# Altium schematic sheet Compute_Module_TOP.SchDoc: STM32F446 CNC
size B; Author: AM; CompanyName: Expatria Technologies; DrawnBy: A.Marles; Engineer: AM; Organization: Expatria Technolgoies; Address1: 1136 Glade Court; Address3: Port Coquitlam, BC V3B 1R5; Address4: Canada; DocumentNumber: 7; SheetNumber: 7; SheetTotal: 30
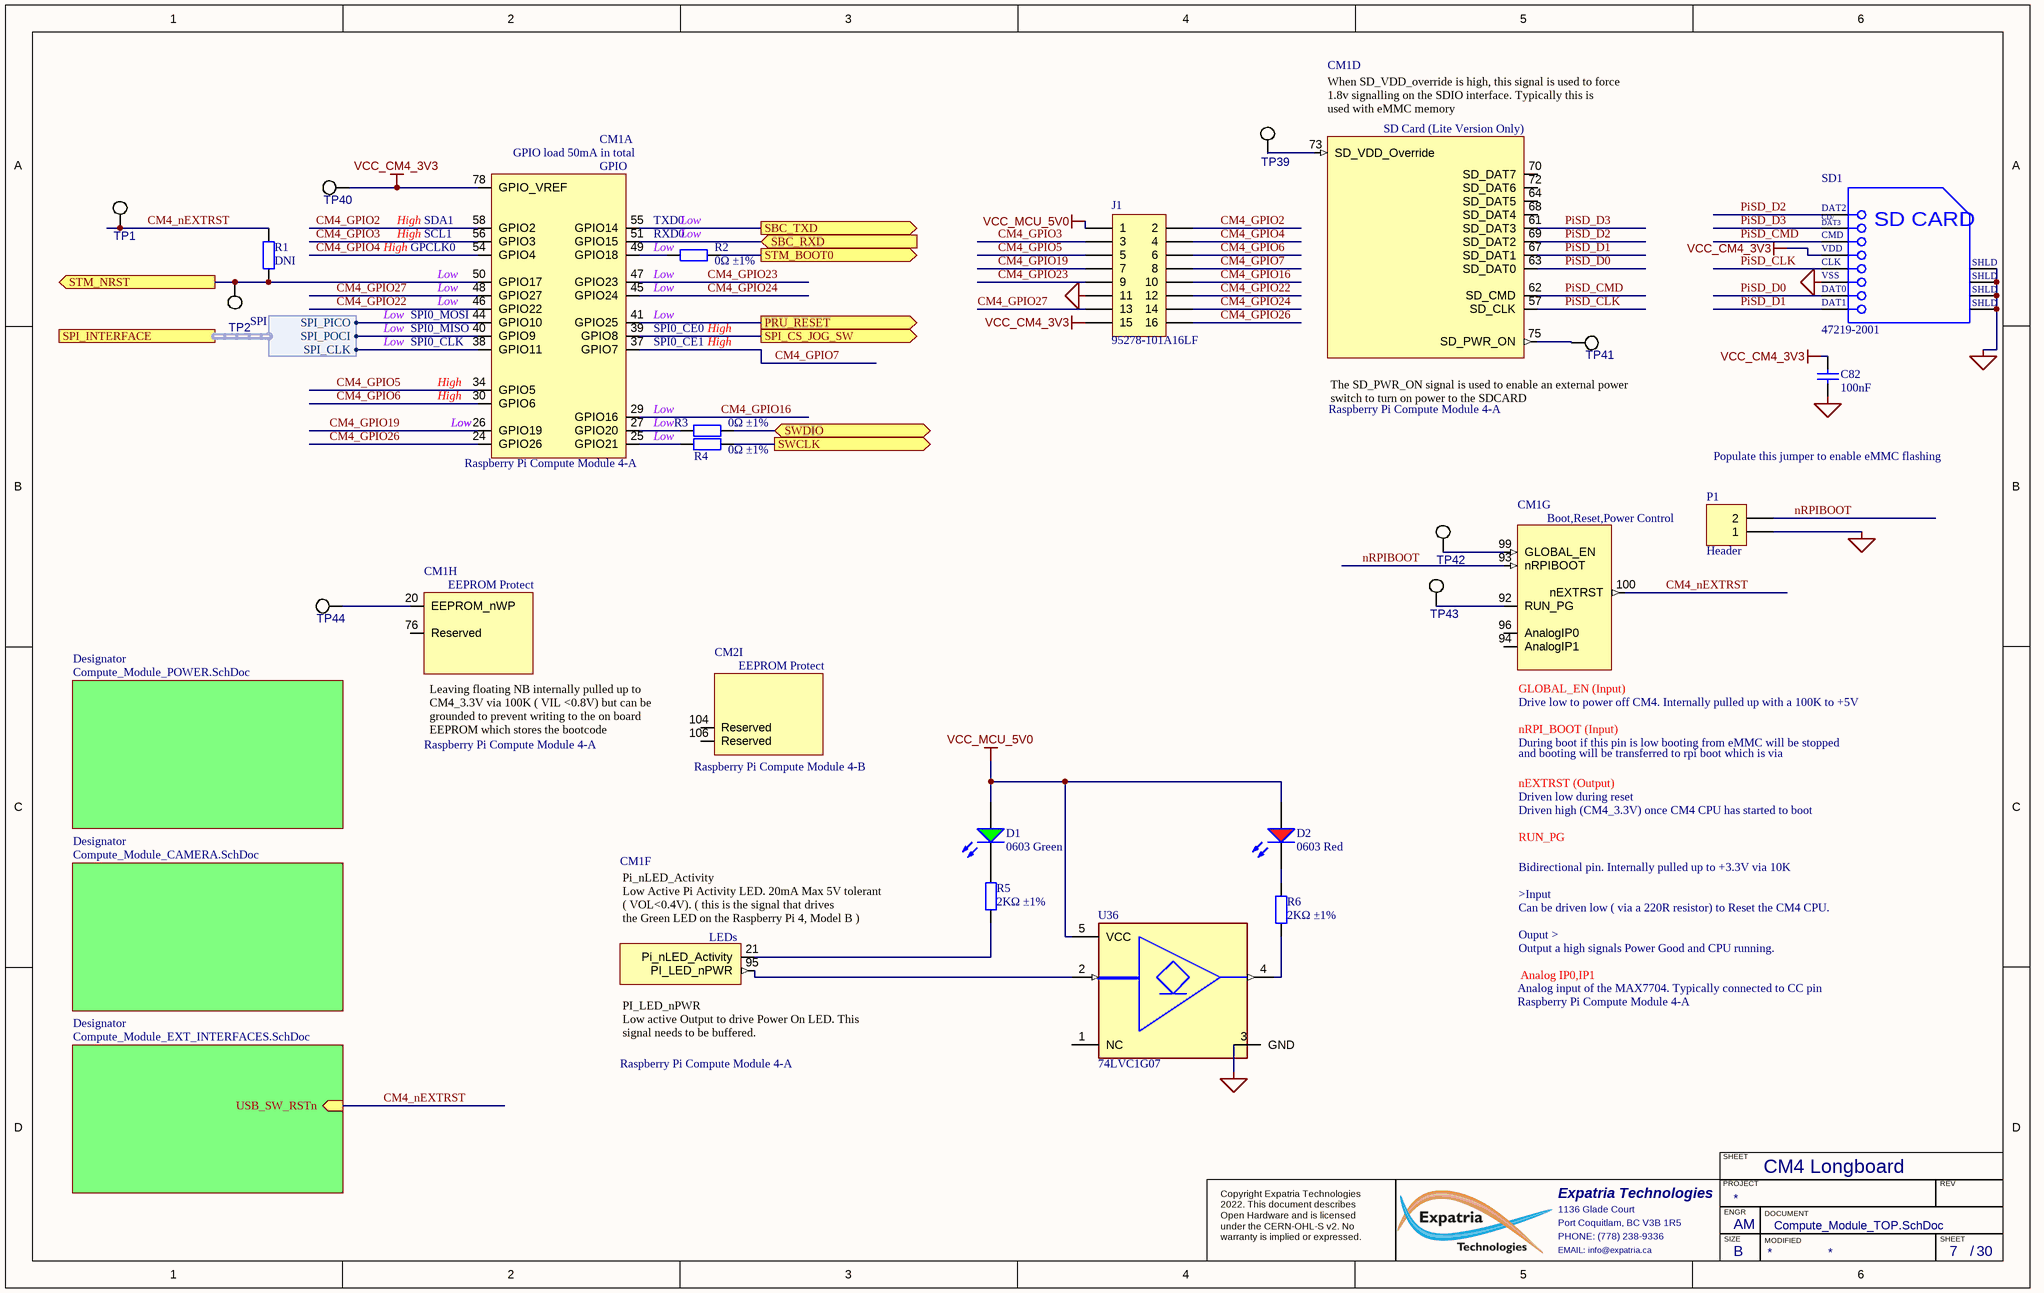
[diagram p0: Compute_Module_TOP.SchDoc]

## Parts
C82  100nF  [0603_C]
CM1  Raspberry Pi Compute Module 4-A  [DF40HC30100DS04V51]  (parts A,D,F,G,H of 14)
CM2  Raspberry Pi Compute Module 4-B  [DF40HC30100DS04V51 - p101-200]  (part I of 10)
D1  0603 Green  [0603_LED_S1]
D2  0603 Red  [0603_LED_S1]
J1  95278-101A16LF  [95278101A16LF]
P1  Header  [HDR1X2]
R1  DNI  [0603_R]
R2  0Ω ±1%  [0603_R]
R3  0Ω ±1%  [0603_R]
R4  0Ω ±1%  [0603_R]
R5  2KΩ ±1%  [0603_R]
R6  2KΩ ±1%  [0603_R]
SD1  47219-2001  [472192001]
TP1  TESTPOINT  [TP/SMALL]  (value not drawn)  (no BOM)
TP2  TESTPOINT  [TP/SMALL]  (value not drawn)  (no BOM)
TP39  TESTPOINT  [TP/SMALL]  (value not drawn)  (no BOM)
TP40  TESTPOINT  [TP/SMALL]  (value not drawn)  (no BOM)
TP41  TESTPOINT  [TP/SMALL]  (value not drawn)  (no BOM)
TP42  TESTPOINT  [TP/SMALL]  (value not drawn)  (no BOM)
TP43  TESTPOINT  [TP/SMALL]  (value not drawn)  (no BOM)
TP44  TESTPOINT  [TP/SMALL]  (value not drawn)  (no BOM)
U36  74LVC1G07  [SOT65P210X110-5N]

## Sub-sheets
Designator = Compute_Module_POWER.SchDoc: no entries
Designator = Compute_Module_EXT_INTERFACES.SchDoc: USB_SW_RSTn (in)
Designator = Compute_Module_CAMERA.SchDoc: no entries

## Ports
PRU_RESET (out), SBC_RXD (in), SBC_TXD (out), SPI_CS_JOG_SW (out), SPI_INTERFACE (harness SPI), STM_BOOT0 (out), STM_NRST (out), SWCLK (out), SWDIO (bidir)

## Harnesses
SPI: SPI_CLK, SPI_PICO, SPI_POCI

## Nets
MCU_GND: C82.1 J1.11 P1.1 SD1.6(VSS) SD1.9(SHLD) SD1.10(SHLD) SD1.11(SHLD) SD1.12(SHLD) U36.3(GND)
VCC_CM4_3V3: C82.2 CM1.78(GPIO_VREF) J1.15 SD1.4(VDD) TP40.1
VCC_MCU_5V0: D1.A D2.A J1.1 U36.5(VCC)
CM4_GPIO2: CM1.58(GPIO2) J1.2
CM4_GPIO3: CM1.56(GPIO3) J1.3
CM4_GPIO4: CM1.54(GPIO4) J1.4
CM4_GPIO5: CM1.34(GPIO5) J1.5
CM4_GPIO6: CM1.30(GPIO6) J1.6
CM4_GPIO7: CM1.37(GPIO7) J1.8
CM4_GPIO16: CM1.29(GPIO16) J1.10
CM4_GPIO19: CM1.26(GPIO19) J1.7
CM4_GPIO22: CM1.46(GPIO22) J1.12
CM4_GPIO23: CM1.47(GPIO23) J1.9
CM4_GPIO24: CM1.45(GPIO24) J1.14
CM4_GPIO26: CM1.24(GPIO26) J1.16
CM4_GPIO27: CM1.48(GPIO27) J1.13
CM4_nEXTRST: CM1.100(nEXTRST) R1.2 TP1.1 ; sheet Designator/USB_SW_RSTn
nRPIBOOT: CM1.93(nRPIBOOT) P1.2
PiSD_CLK: CM1.57(SD_CLK) SD1.5(CLK)
PiSD_CMD: CM1.62(SD_CMD) SD1.3(CMD)
PiSD_D0: CM1.63(SD_DAT0) SD1.7(DAT0)
PiSD_D1: CM1.67(SD_DAT1) SD1.8(DAT1)
PiSD_D2: CM1.69(SD_DAT2) SD1.1(DAT2)
PiSD_D3: CM1.61(SD_DAT3) SD1.2(CD/DAT3)
PRU_RESET: CM1.41(GPIO25) ; port PRU_RESET
SBC_RXD: CM1.51(GPIO15) ; port SBC_RXD
SBC_TXD: CM1.55(GPIO14) ; port SBC_TXD
SPI_CS_JOG_SW: CM1.39(GPIO8) ; port SPI_CS_JOG_SW
STM_BOOT0: R2.1 ; port STM_BOOT0
STM_NRST: CM1.50(GPIO17) R1.1 TP2.1 ; port STM_NRST
SWCLK: R4.1 ; port SWCLK
SWDIO: R3.1 ; port SWDIO
NetCM1_20: CM1.20(EEPROM_nWP) TP44.1
NetCM1_21: CM1.21(Pi_nLED_Activity) R5.1
NetCM1_25: CM1.25(GPIO21) R4.2
NetCM1_27: CM1.27(GPIO20) R3.2
NetCM1_38: CM1.38(GPIO11) ; port SPI_INTERFACE.SPI_CLK
NetCM1_40: CM1.40(GPIO9) ; port SPI_INTERFACE.SPI_POCI
NetCM1_44: CM1.44(GPIO10) ; port SPI_INTERFACE.SPI_PICO
NetCM1_49: CM1.49(GPIO18) R2.2
NetCM1_73: CM1.73(SD_VDD_Override) TP39.1
NetCM1_75: CM1.75(SD_PWR_ON) TP41.1
NetCM1_92: CM1.92(RUN_PG) TP43.1
NetCM1_95: CM1.95(PI_LED_nPWR) U36.2(A)
NetCM1_99: CM1.99(GLOBAL_EN) TP42.1
NetD1_K: D1.K R5.2
NetD2_K: D2.K R6.2
NetR6_1: R6.1 U36.4(Y)

Not connected (* = marked no-connect by the designer): CM1 64(SD_DAT5) 68(SD_DAT4) 70(SD_DAT7) 72(SD_DAT6) 76(Reserved) 94(AnalogIP1) 96(AnalogIP0); CM2 104(Reserved) 106(Reserved); U36 1(NC)

## Notes on the sheet
- Populate this jumper to enable eMMC flashing
- CM4 Longboard
- SHEET
- Expatria Technologies
- 1136 Glade Court
- Port Coquitlam, BC V3B 1R5
- PHONE: (778) 238-9336
- PROJECT
- SIZE
- ENGR
- MODIFIED
- DOCUMENT
- REV
- Copyright Expatria Technologies 2022. This document describes Open Hardware and is licensed under the CERN-OHL-S v2. No warranty is implied or expressed.
- EMAIL: info@expatria.ca
- B
- /
- (in symbol 47219-2001) CD/; DAT3; SD CARD
- (in symbol CM4_Module_A, part A) GPIO load 50mA in total; GPIO; High; SDA1; TXD0; Low; SCL1; RXD0; GPCLK0; SPI0_MOSI; SPI0_MISO; SPI0_CE0; SPI0_CLK; SPI0_CE1; by Amornthep Phunsin
- (in symbol CM4_Module_A, part D) When SD_VDD_override is high, this signal is used to force 1.8v signalling on the SDIO interface. Typically this is / used with eMMC memory; SD Card (Lite Version Only); by Amornthep Phunsin; The SD_PWR_ON signal is used to enable an external power switch to turn on power to the SDCARD
- (in symbol CM4_Module_A, part F) Pi_nLED_Activity / Low Active Pi Activity LED. 20mA Max 5V tolerant ( VOL<0.4V). ( this is the signal that drives / the Green LED on the Raspberry Pi 4, Model B ); LEDs; PI_LED_nPWR / Low active Output to drive Power On LED. This signal needs to be buffered.
- (in symbol CM4_Module_A, part G) Boot,Reset,Power Control; GLOBAL_EN (Input); Drive low to power off CM4. Internally pulled up with a 100K to +5V; nRPI_BOOT (Input); During boot if this pin is low booting from eMMC will be stopped; and booting will be transferred to rpi boot which is via; nEXTRST (Output); Driven low during reset; Driven high (CM4_3.3V) once CM4 CPU has started to boot; Bidirectional pin. Internally pulled up to +3.3V via 10K / >Input / Can be driven low ( via a 220R resistor) to Reset the CM4 CPU. / Ouput > / Output a high signals Power Good and CPU running.; Analog IP0,IP1; Analog input of the MAX7704. Typically connected to CC pin
- (in symbol CM4_Module_A, part H) EEPROM Protect; Leaving floating NB internally pulled up to CM4_3.3V via 100K ( VIL <0.8V) but can be / grounded to prevent writing to the on board EEPROM which stores the bootcode
- (in symbol CM4_Module_B, part I) EEPROM Protect

## Library data of the parts
C82 = 0603 100nF (104) 10% 50V: Chip capacitors; Manufacturer: YAGEO; Manufacturer Part Number: CC0603KRX7R9BB104; Tolerance: 10%; Voltage: 50V; ComponentLink1Description: Supplier link; ComponentLink1URL: http://www.szlcsc.com/product/details_15331.html; Package: 0603; Supplier: LCSC; SuppliersPartNumber: C14663; Capacitance: 100nF
CM1 = CM4_Module_A: Raspberry Pi Compute Module 4 Pins 1-100 (Connector A); Manufacturer: Hirose; Manufacturer Part Number: DF40HC(3.0)-100DS-0.4V(51); SuppliersPartNumber: C424649; Supplier: LCSC; Value: CM4_Module_A
CM2 = CM4_Module_B: Raspberry Pi Compute Module 4 Pins 101-200 (Connector B); Manufacturer: Hirose; Manufacturer Part Number: DF40HC(3.0)-100DS-0.4V(51); SuppliersPartNumber: C424649; Supplier: LCSC; Value: CM4_Module_B
D1 = 0603 LED Green: LED; Manufacturer Part Number: 19-217/GHC-YR1S2/3T; Manufacturer: Everlight Elec; Package: 0603; Supplier: LCSC; SuppliersPartNumber: C72043; Color: Green
D2 = 19-213SURC/S530-A3/TR8: 20mA 632nm Colorless transparence 624nm~624nm -40℃~+85℃ Red 120° 60mW 0603 Light Emitting Diodes (LED) ROHS; Manufacturer 1: Everlight Elec; ComponentLink1Description: 供应商链接; ComponentLink1URL: http://www.szlcsc.com/product/details_2659.html; Package: 0603; Supplier: LCSC; SuppliersPartNumber: C72039; Color: Red; Supplier 1: LC; Supplier Part Number 1: C72039; Manufacturer Part Number 1: 19-213SURC/S530-A3/TR8; Manufacturer: Everlight Elec; Manufacturer Part Number: 19-213SURC/S530-A3/TR8
J1 = 95278-101A16LF: Conn Unshrouded Header HDR 16 POS 2.54mm Solder ST Top Entry SMD BergStik® T/R; Manufacturer: Amphenol ICC / FCI; Supplier 1: LCSC; Supplier Part Number 1: C188235; Manufacturer Part Number: 95278-101A16LF; RoHS: No; Category: Headers and Wire Housings; ComponentLink1URL: https://datasheet.ciiva.com/46395/95278-46395817.pdf?src-supplier=Element14; ComponentLink1Description: https://datasheet.ciiva.com/46395/95278-46395817.pdf?src-supplier=Element14; Value: 95278-101A16LF; SuppliersPartNumber: C188235; Supplier: LCSC
P1 = Header 2: Straight Square Pins 2 2.54mm Black Brass 1x2P Plugin,P=2.54mm Pin Headers ROHS; Manufacturer 1: MOLEX; Manufacturer Part Number 1: 22284020; Publisher: Altium Limited; LatestRevisionDate: 17-Jul-2002; LatestRevisionNote: Re-released for DXP Platform.; SuppliersPartNumber: C234182; Supplier 1: LCSC; Supplier Part Number 1: C234182; Manufacturer: MOLEX; Manufacturer Part Number: 22284020
R1 = 0603 2K (2001) 1%: Chip resistor; Manufacturer: Uniroyal Elec; PartNumber: 0603WAF2001T5E; Power: 1/10W; Resistance: 2KΩ; Tolerance: 1%; ComponentLink1Description: Supplier link; ComponentLink1URL: http://www.szlcsc.com/product/details_23702.html; Package: 0603; Supplier: LCSC; SuppliersPartNumber: C22975; Manufacturer Part Number: 0603WAF2001T5E
R2-R4 = 0603 0R (0R0) 1%: Chip resistor; Manufacturer: Uniroyal Elec; PartNumber: 0603WAF0000T5E; Power: 1/10W; ComponentLink1Description: Supplier link; ComponentLink1URL: http://www.szlcsc.com/product/details_21903.html; Package: 0603; Supplier: LCSC; SuppliersPartNumber: C21189; Resistance: 0Ω; Tolerance: 1%; Manufacturer Part Number: 0603WAF0000T5E
R5 R6 = 0603 2K (2001) 1%: Chip resistor; Manufacturer: Uniroyal Elec; PartNumber: 0603WAF2001T5E; Power: 1/10W; ComponentLink1Description: Supplier link; ComponentLink1URL: http://www.szlcsc.com/product/details_23702.html; Package: 0603; Supplier: LCSC; SuppliersPartNumber: C22975; Resistance: 2KΩ; Tolerance: 1%; Manufacturer Part Number: 0603WAF2001T5E
SD1 = 47219-2001: Conn Micro SD Card SKT 8 POS 1.1mm Solder RA SMD 0.5A/Contact Embossed T/R; Manufacturer: Molex; Manufacturer Part Number 1: 0472192001; Current Rating: 500mA; Number of Contacts: 8; Pitch: 1.09mm; Insertion - Extraction Style: Hinged; Voltage Rating: 100VDC; Voltage Rating (DC): 100V; Gender: Female; Shielding: Shielded; Product: CardConnectors; Contact Material: CopperAlloy; Series: 47219; Packaging: Reel; Brand: Molex; Product Category: MemoryCardConnectors; Housing Material: Thermoplastic; Mounting Style: SMD/SMT; Termination Style: SMD; Datasheet Version: Rev. F, 06/2009; Card Type: microSD; Manufacturer URL: http://www.molex.com/; RoHS: Details; Datasheet URL: http://www.molex.com/pdm_docs/sd/472192001_sd.pdf; Factory Pack Quantity: 2400; Manufacturer Part Number: 47219-2001; Supplier 1: LCSC; Supplier Part Number 1: C164170; Category: Memory Connectors; Stock 1: 22700; Pricing 1: 1=0.573200, 10=0.487200, 30=0.425200, 100=0.375300, 500=0.359800, 800=0.308400 (AUD); Mount: Surface Mount; Contact Plating: Gold; Color: Black; Material: Thermoplastic; Min Operating Temperature: -20°C; Max Operating Temperature: 85°C; Orientation: Horizontal; Package Quantity: 2400; Termination: SMD/SMT; Number of Circuits: 8; Length: 13.6mm; Width: 14.5mm; Depth: 1.9mm; Radiation Hardening: No; RoHS Compliant: Yes; Lead Free: Lead Free; Halogen Free: Low Halogen; ELV: Compliant; ComponentLink1URL: https://datasheet.ciiva.com/30153/0472192001-memory-card-socket-30153816.pdf?src-supplier=Onlinecomponents.com; ComponentLink1Description: https://datasheet.ciiva.com/30153/0472192001-memory-card-socket-30153816.pdf?src-supplier=Onlinecomponents.com; ComponentLink2URL: https://datasheet.ciiva.com/24444/260460472192001-memory-card-socket-24444480.pdf?src-supplier=Onlinecomponents.com; ComponentLink2Description: https://datasheet.ciiva.com/24444/260460472192001-memory-card-socket-24444480.pdf?src-supplier=Onlinecomponents.com; ComponentLink3URL: https://datasheet.ciiva.com/16655/0472192001-memory-card-socket-16655591.pdf?; ComponentLink3Description: https://datasheet.ciiva.com/16655/0472192001-memory-card-socket-16655591.pdf?; SuppliersPartNumber: C164170; Supplier: LCSC
TP1 TP2 TP39-TP44 = TESTPOINT: Test Point; Manufacturer 1: N/A; Manufacturer Part Number 1: N/A; Value: Testpoint
U36 = 74LVC1G07: IC BUF NON-INVERT 5.5V SOT353; Manufacturer: Wuxi I-core Elec; Manufacturer Part Number: 74LVC1G07; Package: SOT353; Value: 74LVC1G07; SuppliersPartNumber: C5138996; Supplier: LCSC